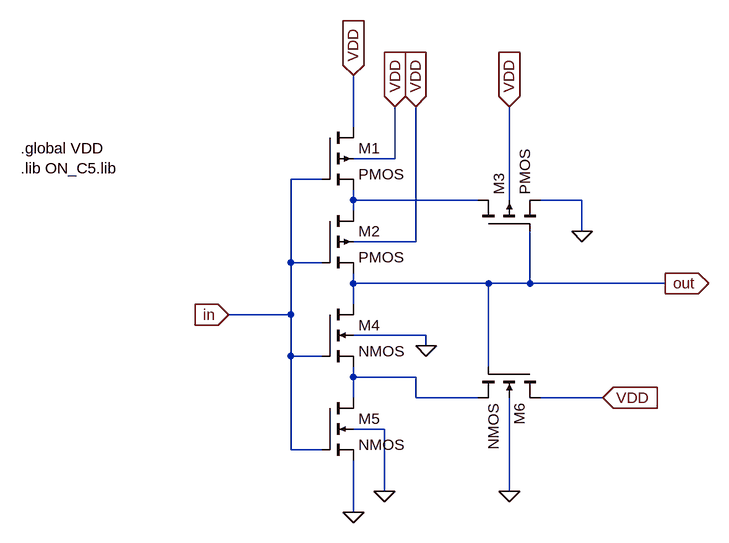
[diagram p0: schematic Schmitt_trigger.asc]
Schmitt_trigger.asc, the LTspice schematic file:
Version 4
SHEET 1 880 680
WIRE 144 0 144 -80
WIRE 208 48 208 -32
WIRE 208 48 144 48
WIRE 96 80 48 80
WIRE 144 112 144 96
WIRE 336 112 144 112
WIRE 384 112 384 -32
WIRE 496 112 432 112
WIRE 144 128 144 112
WIRE 496 160 496 112
WIRE 240 176 240 -32
WIRE 240 176 144 176
WIRE 48 208 48 80
WIRE 96 208 48 208
WIRE 144 240 144 224
WIRE 352 240 144 240
WIRE 416 240 416 160
WIRE 416 240 352 240
WIRE 624 240 416 240
WIRE 144 272 144 240
WIRE 48 288 48 208
WIRE 48 288 -48 288
WIRE 256 320 144 320
WIRE 256 336 256 320
WIRE 48 352 48 288
WIRE 96 352 48 352
WIRE 352 368 352 240
WIRE 144 384 144 368
WIRE 240 384 144 384
WIRE 144 416 144 384
WIRE 240 416 240 384
WIRE 336 416 240 416
WIRE 528 416 432 416
WIRE 192 464 144 464
WIRE 48 496 48 352
WIRE 96 496 48 496
WIRE 192 560 192 464
WIRE 384 560 384 416
WIRE 144 592 144 512
FLAG 144 -80 VDD
IOPIN 144 -80 In
FLAG 496 160 0
FLAG 144 592 0
FLAG 528 416 VDD
IOPIN 528 416 In
FLAG 384 560 0
FLAG 192 560 0
FLAG 624 240 out
IOPIN 624 240 Out
FLAG -48 288 in
IOPIN -48 288 In
FLAG 256 336 0
FLAG 208 -32 VDD
IOPIN 208 -32 In
FLAG 240 -32 VDD
IOPIN 240 -32 In
FLAG 384 -32 VDD
IOPIN 384 -32 In
SYMBOL pmos4 96 0 R0
SYMATTR InstName M1
SYMATTR Value2 l=3u w=3.5u
SYMBOL pmos4 96 128 R0
SYMATTR InstName M2
SYMATTR Value2 l=3u w=3.5u
SYMBOL pmos4 336 160 R270
SYMATTR InstName M3
SYMATTR Value2 l=4.5u w=8u
SYMBOL nmos4 96 272 R0
SYMATTR InstName M4
SYMATTR Value2 l=3.3u w=10.5u
SYMBOL nmos4 96 416 R0
SYMATTR InstName M5
SYMATTR Value2 l=3.3u w=10.5u
SYMBOL nmos4 432 368 R90
SYMATTR InstName M6
SYMATTR Value2 l=0.58u w=54u
TEXT -368 32 Left 2 !.global VDD\n.lib ON_C5.lib

The netlist it stands for:
* Schmitt_trigger.asc
M1 VDD in N001 VDD PMOS l=3u w=3.5u
M2 N001 in out VDD PMOS l=3u w=3.5u
M3 N001 out 0 VDD PMOS l=4.5u w=8u
M4 out in N002 0 NMOS l=3.3u w=10.5u
M5 N002 in 0 0 NMOS l=3.3u w=10.5u
M6 VDD out N002 0 NMOS l=0.58u w=54u
.model NMOS NMOS
.model PMOS PMOS
.lib standard.mos
.global VDD
.lib ON_C5.lib
.backanno
.end